# EAGLE design gt-jtx-m32-ver1.0 (EAGLE 6.3)
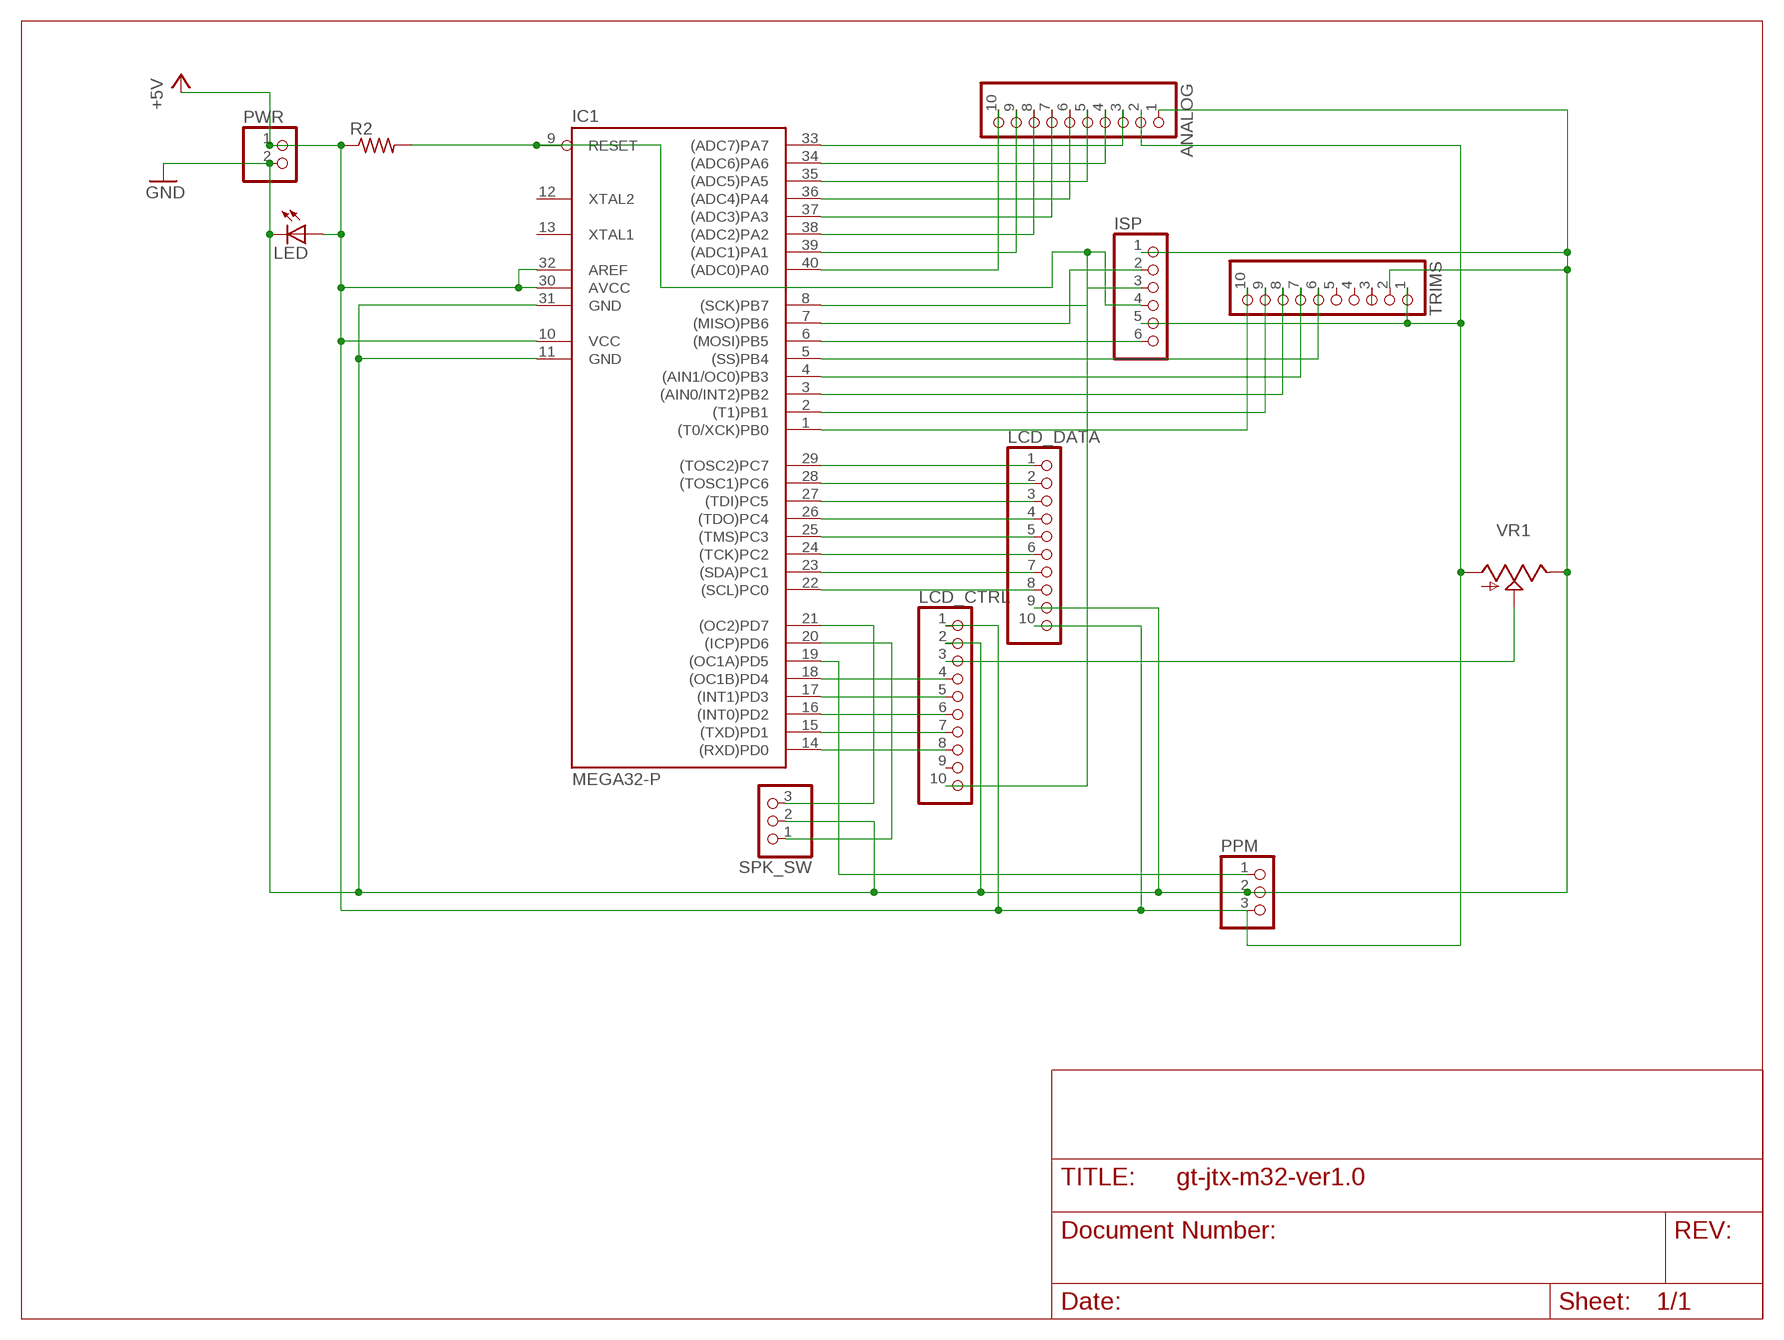
[diagram p0: schematic, sheet 1]

## Parts
ANALOG  PINHD-1X10  [1X10]
IC1  MEGA32-P  [DIL40]
ISP  PINHD-1X6  [1X06]
LCD_CTRL  PINHD-1X10  [1X10]
LCD_DATA  PINHD-1X10  [1X10]
LED  LED5MM  [LED5MM]
PPM  PINHD-1X3  [1X03]
PWR  PINHD-1X2  [1X02]
R2  R-US_0204/2V  [0204V]
SPK_SW  PINHD-1X3  [1X03]
TRIMS  PINHD-1X10  [1X10]
VR1  TRIM_US-CA6V  [CA6V]

## Nets
+5V: ANALOG.2 IC1.10(VCC) IC1.30(AVCC) IC1.32(AREF) ISP.5 LCD_CTRL.1 LCD_DATA.10 LED.A PPM.3 PWR.1 R2.1 TRIMS.1 VR1.A
CONTRA_ADJ: LCD_CTRL.3 VR1.S
CS1: IC1.17((INT1)PD3) LCD_CTRL.5
CS2: IC1.18((OC1B)PD4) LCD_CTRL.4
D0: IC1.22((SCL)PC0) LCD_DATA.8
D1: IC1.23((SDA)PC1) LCD_DATA.7
D2: IC1.24((TCK)PC2) LCD_DATA.6
D3: IC1.25((TMS)PC3) LCD_DATA.5
D4: IC1.26((TDO)PC4) LCD_DATA.4
D5: IC1.27((TDI)PC5) LCD_DATA.3
D6: IC1.28((TOSC1)PC6) LCD_DATA.2
D7: IC1.29((TOSC2)PC7) LCD_DATA.1
E: IC1.16((INT0)PD2) LCD_CTRL.6
GND: ANALOG.1 IC1.11(GND) IC1.31(GND) ISP.1 LCD_CTRL.2 LCD_DATA.9 LED.K(C) PPM.2 PWR.2 SPK_SW.2 TRIMS.2 VR1.E
N$1: ANALOG.10 IC1.40((ADC0)PA0)
N$2: ANALOG.9 IC1.39((ADC1)PA1)
N$3: ANALOG.8 IC1.38((ADC2)PA2)
N$4: ANALOG.7 IC1.37((ADC3)PA3)
N$5: IC1.20((ICP)PD6) SPK_SW.1
N$6: IC1.21((OC2)PD7) SPK_SW.3
N$8: ANALOG.6 IC1.36((ADC4)PA4)
N$9: IC1.9(RESET) ISP.4 LCD_CTRL.10 R2.2
N$10: ANALOG.5 IC1.35((ADC5)PA5)
N$11: ANALOG.4 IC1.34((ADC6)PA6)
N$12: IC1.6((MOSI)PB5) ISP.6
N$13: IC1.7((MISO)PB6) ISP.2
N$14: IC1.8((SCK)PB7) ISP.3
N$15: IC1.19((OC1A)PD5) PPM.1
N$17: ANALOG.3 IC1.33((ADC7)PA7)
N$27: IC1.1((T0/XCK)PB0) TRIMS.10
N$28: TRIMS.3
N$29: IC1.2((T1)PB1) TRIMS.9
N$30: IC1.3((AIN0/INT2)PB2) TRIMS.8
N$31: IC1.4((AIN1/OC0)PB3) TRIMS.7
N$32: IC1.5((SS)PB4) TRIMS.6
RS: IC1.14((RXD)PD0) LCD_CTRL.8
RW: IC1.15((TXD)PD1) LCD_CTRL.7
Unconnected: IC1.12(XTAL2) IC1.13(XTAL1) LCD_CTRL.9 TRIMS.4 TRIMS.5

## Library data of the parts
ANALOG LCD_CTRL LCD_DATA TRIMS = pinhead:PINHD-1X10: PIN HEADER
IC1 = atmel:MEGA32-P: MICROCONTROLLER 32 Kbytes FLASH 2 Kbytes SRAM 1 Kbytes EEPROM USART 8-channel 10 bit ADC Source: www.atmel.com .. doc2503.pdf; MPN: ATMEGA32-16PU; OC_FARNELL: 1661729; OC_NEWARK: 51P1794
ISP = pinhead:PINHD-1X6: PIN HEADER
LED = led:LED: LED OSRAM: - CHIPLED LG R971, LG N971, LY N971, LG Q971, LY Q971, LO R971, LY R971 LH N974, LH R974 LS Q976, LO Q976, LY Q976 LO Q996 - Hyper CHIPLED LW Q18S LB Q993, LB Q99A, LB R99A - SideLED LS A670, LO A670, LY A670, LG A670, LP A670 LB A673, LV A673, LT A673, LW A673 LH A674 LY A675 LS A676, LA A676, LO A676, LY A676, LW A676 LS A679, LY A679, LG A679 - Hyper Micro SIDELED® LS Y876, LA Y876, LO Y876, LY Y876 LT Y87S - SmartLED LW L88C, LW L88S LB L89C, LB L89S, LG L890 LS L89K, LO L89K, LY L89K LS L896, LA L896, LO L896, LY L896 - TOPLED LS T670, LO T670, LY T670, LG T670, LP T670 LSG T670, LSP T670, LSY T670, LOP T670, LYG T670 LG T671, LOG T671, LSG T671 LB T673, LV T673, LT T673, LW T673 LH T674 LS T676, LA T676, LO T676, LY T676, LB T676, LH T676, LSB T676, LW T676 LB T67C, LV T67C, LT T67C, LS T67K, LO T67K, LY T67K, LW E67C LS E67B, LA E67B, LO E67B, LY E67B, LB E67C, LV E67C, LT E67C LW T67C LS T679, LY T679, LG T679 LS T770, LO T770, LY T770, LG T770, LP T770 LB T773, LV T773, LT T773, LW T773 LH T774 LS E675, LA E675, LY E675, LS T675 LS T776, LA T776, LO T776, LY T776, LB T776 LHGB T686 LT T68C, LB T68C - Hyper Mini TOPLED® LB M676 - Mini TOPLED Santana® LG M470 LS M47K, LO M47K, LY M47K Source: http://www.osram.convergy.de LUXEON: - LUMILED® LXK2-PW12-R00, LXK2-PW12-S00, LXK2-PW14-U00, LXK2-PW14-V00 LXK2-PM12-R00, LXK2-PM12-S00, LXK2-PM14-U00 LXK2-PE12-Q00, LXK2-PE12-R00, LXK2-PE12-S00, LXK2-PE14-T00, LXK2-PE14-U00 LXK2-PB12-K00, LXK2-PB12-L00, LXK2-PB12-M00, LXK2-PB14-N00, LXK2-PB14-P00, LXK2-PB14-Q00 LXK2-PR12-L00, LXK2-PR12-M00, LXK2-PR14-Q00, LXK2-PR14-R00 LXK2-PD12-Q00, LXK2-PD12-R00, LXK2-PD12-S00 LXK2-PH12-R00, LXK2-PH12-S00 LXK2-PL12-P00, LXK2-PL12-Q00, LXK2-PL12-R00 Source: www.luxeon.com KINGBRIGHT: KA-3528ASYC Source: www.kingbright.com
PPM SPK_SW = pinhead:PINHD-1X3: PIN HEADER
PWR = pinhead:PINHD-1X2: PIN HEADER
R2 = resistor:R-US_: RESISTOR, American symbol
VR1 = pot:TRIM_US-: POTENTIOMETER

## Board
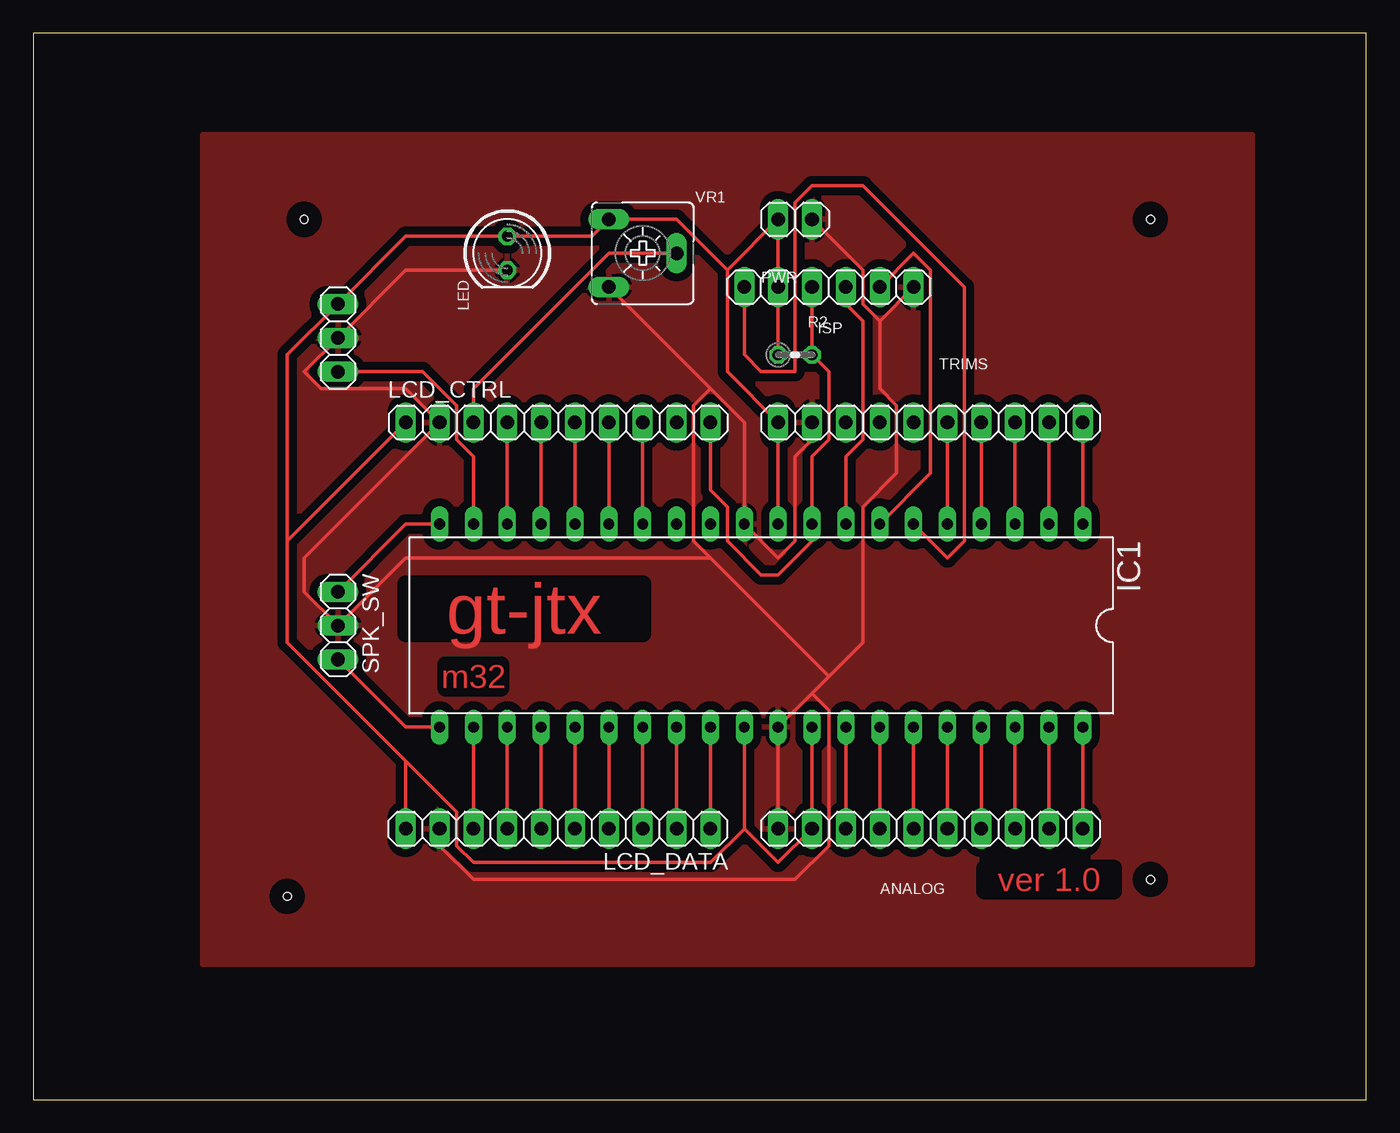
[diagram p1: board, top side]

Size 100 x 80 mm. Coordinates in mm from the lower left corner, seen from the top.
Outline: 0,0 100,0 100,80 0,80 0,0
Copper layers (1*16): Top 0.035mm / dielectric 1.5mm / Bottom 0.035mm
Design rules "default": minimum track width 10mil, minimum drill 24mil, track to track 8mil, track to pad 8mil, pad to pad 8mil, via to via 8mil, smd to smd 8mil, copper to edge 40mil, drill to drill 8mil, minimum pad ring 10mil, minimum via ring 8mil, stop-mask expansion 4mil, vias tented up to drill 0mil, thermal gap 10mil
Holes 0.6 mm at 19.05,15.24 83.82,16.51 83.82,66.04 20.32,66.04

### Footprints (pad centres in the part's own frame; a part is rotated, then mirrored left to right if it is on the bottom)
1X10 = drill 1.016 long: 1 -11.43,0; 2 -8.89,0; 3 -6.35,0; 4 -3.81,0; 5 -1.27,0; 6 1.27,0; 7 3.81,0; 8 6.35,0; 9 8.89,0; 10 11.43,0
DIL40 = drill 0.813 long: 1 -24.13,-7.62; 2 -21.59,-7.62; 3 -19.05,-7.62; 4 -16.51,-7.62; 5 -13.97,-7.62; 6 -11.43,-7.62; 7 -8.89,-7.62; 8 -6.35,-7.62; 9 -3.81,-7.62; 10 -1.27,-7.62; 11 1.27,-7.62; 12 3.81,-7.62; 13 6.35,-7.62; 14 8.89,-7.62; 15 11.43,-7.62; 16 13.97,-7.62; 17 16.51,-7.62; 18 19.05,-7.62; 19 21.59,-7.62; 20 24.13,-7.62; 21 24.13,7.62; 22 21.59,7.62; 23 19.05,7.62; 24 16.51,7.62; 25 13.97,7.62; 26 11.43,7.62; 27 8.89,7.62; 28 6.35,7.62; 29 3.81,7.62; 30 1.27,7.62; 31 -1.27,7.62; 32 -3.81,7.62; 33 -6.35,7.62; 34 -8.89,7.62; 35 -11.43,7.62; 36 -13.97,7.62; 37 -16.51,7.62; 38 -19.05,7.62; 39 -21.59,7.62; 40 -24.13,7.62
1X06 = drill 1.016 long: 1 -6.35,0; 2 -3.81,0; 3 -1.27,0; 4 1.27,0; 5 3.81,0; 6 6.35,0
LED5MM = drill 0.813 octagon: A -1.27,0; K 1.27,0
1X03 = drill 1.016 long: 1 -2.54,0; 2 0,0; 3 2.54,0
1X02 = drill 1.016 long: 1 -1.27,0; 2 1.27,0
0204V = drill 0.813 octagon: 1 -1.27,0; 2 1.27,0
CA6V = drill 1.016 long: A -2.54,-2.54; E 2.54,-2.54; S 0,2.54

### Placement (x,y rotation side)
ANALOG  67.31,20.32 0 top
IC1  54.61,35.56 180 top
ISP  59.69,60.96 180 top
LCD_CTRL  39.37,50.8 0 top
LCD_DATA  39.37,20.32 180 top
LED  35.56,63.5 270 top
PPM  22.86,57.15 90 top
PWR  57.15,66.04 0 top
R2  57.15,55.88 0 top
SPK_SW  22.86,35.56 270 top
TRIMS  67.31,50.8 0 top
VR1  45.72,63.5 270 top

### Tracks (layer width: path | path; a pad name or v marks a point on that pad's centre or on a via)
+5V
  Top 0.254: IC1.10 TRIMS.1 52.07,54.61 52.07,62.23 | R2.1 ISP.5 PWR.1 52.07,62.23 | 52.07,62.23 48.26,66.04 VR1.A 41.91,64.77 LED.A 27.94,64.77 PPM.3 19.05,55.88 19.05,41.91 | 53.34,20.32 IC1.30 | 53.34,20.32 55.88,17.78 ANALOG.2 IC1.32 | 27.94,25.4 LCD_DATA.10 | 27.94,25.4 19.05,34.29 19.05,41.91 | LCD_CTRL.1 19.05,41.91 | 53.34,20.32 50.8,17.78 33.02,17.78 31.75,19.05 31.75,21.59 27.94,25.4
CONTRA_ADJ
  Top 0.254: LCD_CTRL.3 33.02,53.34 43.18,63.5 VR1.S
CS1
  Top 0.254: LCD_CTRL.5 IC1.17
CS2
  Top 0.254: LCD_CTRL.4 IC1.18
D0
  Top 0.254: LCD_DATA.8 IC1.22
D1
  Top 0.254: LCD_DATA.7 IC1.23
D2
  Top 0.254: LCD_DATA.6 IC1.24
D3
  Top 0.254: LCD_DATA.5 IC1.25
D4
  Top 0.254: LCD_DATA.4 IC1.26
D5
  Top 0.254: LCD_DATA.3 IC1.27
D6
  Top 0.254: LCD_DATA.2 IC1.28
D7
  Top 0.254: LCD_DATA.1 IC1.29
E
  Top 0.254: LCD_CTRL.6 IC1.16
GND
  Top 0.254: LED.K 27.94,62.23 PPM.2 20.32,54.61 21.59,53.34 27.94,53.34 LCD_CTRL.2 20.32,40.64 20.32,38.1 SPK_SW.2 27.94,40.64 50.8,40.64 | VR1.E 50.8,53.34 | 50.8,53.34 53.34,50.8 IC1.11 55.88,40.64 57.15,41.91 57.15,48.26 58.42,49.53 TRIMS.2 | PWR.2 62.23,62.23 62.23,59.69 63.5,58.42 | ISP.1 63.5,58.42 | ANALOG.1 IC1.31 58.42,30.48 | LCD_DATA.9 30.48,19.05 33.02,16.51 57.15,16.51 59.69,19.05 59.69,29.21 58.42,30.48 | 63.5,58.42 63.5,53.34 64.77,52.07 64.77,46.99 62.23,44.45 62.23,34.29 59.69,31.75 | 58.42,30.48 59.69,31.75 | 50.8,53.34 49.53,52.07 49.53,41.91 50.8,40.64 | 59.69,31.75 50.8,40.64
  pour Top (isolate 0.61): 12.7,72.39 91.44,72.39 91.44,10.16 12.7,10.16
N$1
  Top 0.254: ANALOG.10 IC1.40
N$2
  Top 0.254: ANALOG.9 IC1.39
N$3
  Top 0.254: ANALOG.8 IC1.38
N$4
  Top 0.254: ANALOG.7 IC1.37
N$5
  Top 0.254: IC1.20 27.94,43.18 SPK_SW.1
N$6
  Top 0.254: IC1.21 27.94,27.94 SPK_SW.3
N$8
  Top 0.254: ANALOG.6 IC1.36
N$9
  Top 0.254: LCD_CTRL.10 50.8,45.72 52.07,44.45 52.07,41.91 54.61,39.37 55.88,39.37 58.42,41.91 IC1.9 58.42,48.26 59.69,49.53 59.69,54.61 R2.2 ISP.4
N$10
  Top 0.254: ANALOG.5 IC1.35
N$11
  Top 0.254: ANALOG.4 IC1.34
N$12
  Top 0.254: IC1.6 68.58,40.64 69.85,41.91 69.85,60.96 62.23,68.58 58.42,68.58 57.15,67.31 57.15,54.61 54.61,54.61 53.34,55.88 ISP.6
N$13
  Top 0.254: IC1.7 67.31,46.99 67.31,62.23 66.04,63.5 ISP.2
N$14
  Top 0.254: IC1.8 60.96,48.26 62.23,49.53 62.23,58.42 60.96,59.69 ISP.3
N$15
  Top 0.254: IC1.19 33.02,48.26 31.75,49.53 31.75,52.07 29.21,54.61 PPM.1
N$17
  Top 0.254: ANALOG.3 IC1.33
N$27
  Top 0.254: TRIMS.10 IC1.1
N$29
  Top 0.254: TRIMS.9 IC1.2
N$30
  Top 0.254: TRIMS.8 IC1.3
N$31
  Top 0.254: TRIMS.7 IC1.4
N$32
  Top 0.254: TRIMS.6 IC1.5
RS
  Top 0.254: LCD_CTRL.8 IC1.14
RW
  Top 0.254: LCD_CTRL.7 IC1.15

### Text on the board
Top: gt-jtx | m32 | ver 1.0